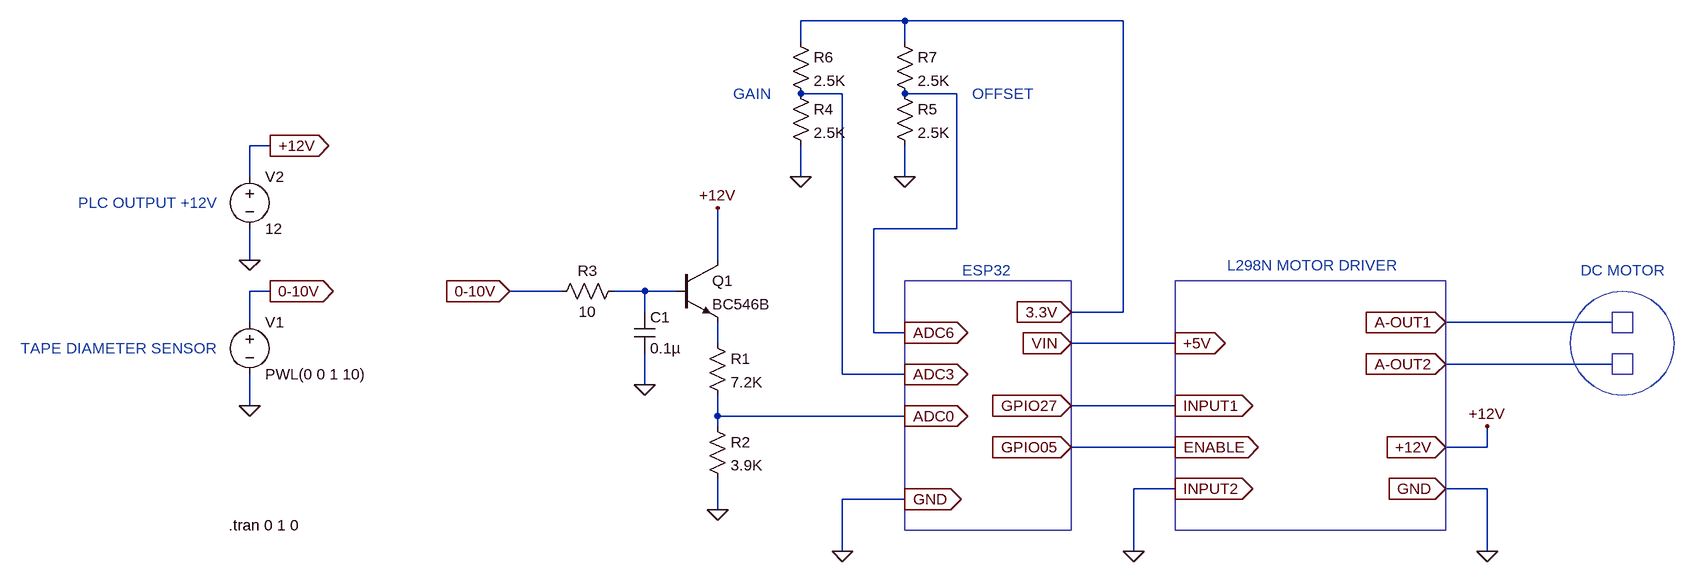
[diagram p0: schematic schemetic.asc]
schemetic.asc, the LTspice schematic file:
Version 4
SHEET 1 1764 680
WIRE 576 -400 416 -400
WIRE 912 -400 576 -400
WIRE 416 -368 416 -400
WIRE 576 -368 576 -400
WIRE 480 -288 416 -288
WIRE 656 -288 576 -288
WIRE -400 -208 -432 -208
WIRE -432 -160 -432 -208
WIRE 416 -160 416 -208
WIRE 576 -160 576 -208
WIRE 656 -80 656 -288
WIRE 656 -80 528 -80
WIRE -432 -32 -432 -80
WIRE 288 -32 288 -112
WIRE -400 16 -432 16
WIRE 48 16 -32 16
WIRE 176 16 128 16
WIRE 224 16 176 16
WIRE 176 48 176 16
WIRE 912 48 912 -400
WIRE 912 48 832 48
WIRE -432 64 -432 16
WIRE 1664 64 1408 64
WIRE 528 80 528 -80
WIRE 576 80 528 80
WIRE 288 96 288 64
WIRE 992 96 832 96
WIRE 1664 128 1408 128
WIRE 480 144 480 -288
WIRE 576 144 480 144
WIRE 176 160 176 112
WIRE -432 192 -432 144
WIRE 992 192 832 192
WIRE 288 208 288 176
WIRE 576 208 288 208
WIRE 288 224 288 208
WIRE 992 256 832 256
WIRE 1472 256 1472 224
WIRE 1472 256 1408 256
WIRE 992 320 928 320
WIRE 1472 320 1408 320
WIRE 576 336 480 336
WIRE 288 352 288 304
WIRE 480 416 480 336
WIRE 928 416 928 320
WIRE 1472 416 1472 320
FLAG 288 352 0
FLAG 288 -112 +12V
FLAG 176 160 0
FLAG -32 16 0-10V
IOPIN -32 16 In
FLAG -432 192 0
FLAG -400 16 0-10V
IOPIN -400 16 Out
FLAG -432 -32 0
FLAG -400 -208 +12V
IOPIN -400 -208 Out
FLAG 576 208 ADC0
IOPIN 576 208 Out
FLAG 832 192 GPIO27
IOPIN 832 192 In
FLAG 832 256 GPIO05
IOPIN 832 256 In
FLAG 992 192 INPUT1
IOPIN 992 192 Out
FLAG 992 256 ENABLE
IOPIN 992 256 Out
FLAG 992 320 INPUT2
IOPIN 992 320 Out
FLAG 928 416 0
FLAG 832 96 VIN
IOPIN 832 96 In
FLAG 992 96 +5V
IOPIN 992 96 Out
FLAG 1408 320 GND
IOPIN 1408 320 In
FLAG 1408 256 +12V
IOPIN 1408 256 In
FLAG 1408 128 A-OUT2
IOPIN 1408 128 In
FLAG 1408 64 A-OUT1
IOPIN 1408 64 In
FLAG 1472 416 0
FLAG 480 416 0
FLAG 576 336 GND
IOPIN 576 336 Out
FLAG 832 48 3.3V
IOPIN 832 48 In
FLAG 576 144 ADC3
IOPIN 576 144 Out
FLAG 576 80 ADC6
IOPIN 576 80 Out
FLAG 416 -160 0
FLAG 576 -160 0
FLAG 1472 224 +12V
SYMBOL npn 224 -32 R0
SYMATTR InstName Q1
SYMATTR Value BC546B
SYMBOL res 272 80 R0
SYMATTR InstName R1
SYMATTR Value 7.2K
SYMBOL res 272 208 R0
SYMATTR InstName R2
SYMATTR Value 3.9K
SYMBOL res 144 0 R90
WINDOW 0 0 56 VBottom 2
WINDOW 3 32 56 VTop 2
SYMATTR InstName R3
SYMATTR Value 10
SYMBOL cap 160 48 R0
SYMATTR InstName C1
SYMATTR Value 0.1µ
SYMBOL voltage -432 48 R0
WINDOW 123 0 0 Left 0
WINDOW 39 0 0 Left 0
SYMATTR InstName V1
SYMATTR Value PWL(0 0 1 10)
SYMBOL voltage -432 -176 R0
WINDOW 123 0 0 Left 0
WINDOW 39 0 0 Left 0
SYMATTR InstName V2
SYMATTR Value 12
SYMBOL res 400 -304 R0
SYMATTR InstName R4
SYMATTR Value 2.5K
SYMBOL res 560 -304 R0
SYMATTR InstName R5
SYMATTR Value 2.5K
SYMBOL res 400 -384 R0
SYMATTR InstName R6
SYMATTR Value 2.5K
SYMBOL res 560 -384 R0
SYMATTR InstName R7
SYMATTR Value 2.5K
TEXT 664 -16 Left 2 ;ESP32
TEXT -464 376 Left 2 !.tran 0 1 0
TEXT 1072 -24 Left 2 ;L298N MOTOR DRIVER
TEXT 312 -288 Left 2 ;GAIN
TEXT 680 -288 Left 2 ;OFFSET
TEXT 1616 -16 Left 2 ;DC MOTOR
TEXT -784 104 Left 2 ;TAPE DIAMETER SENSOR
TEXT -696 -120 Left 2 ;PLC OUTPUT +12V
RECTANGLE Normal 576 0 832 384
RECTANGLE Normal 1408 0 992 384
RECTANGLE Normal 1696 80 1664 48
RECTANGLE Normal 1696 144 1664 112
CIRCLE Normal 1760 176 1600 16

The netlist it stands for:
* schemetic.asc
Q1 +12V N001 N002 0 BC546B
R1 N002 ADC0 7.2K
R2 ADC0 0 3.9K
R3 N001 0-10V 10
C1 N001 0 0.1µ
V1 0-10V 0 PWL(0 0 1 10)
V2 +12V 0 12
R4 ADC3 0 2.5K
R5 ADC6 0 2.5K
R6 3.3V ADC3 2.5K
R7 3.3V ADC6 2.5K
.model NPN NPN
.model PNP PNP
.lib standard.bjt
* ESP32
.tran 0 1 0
* L298N MOTOR DRIVER
* GAIN
* OFFSET
* DC MOTOR
* TAPE DIAMETER SENSOR
* PLC OUTPUT +12V
.backanno
.end